# Altium project Atmega328P.PrjPcb
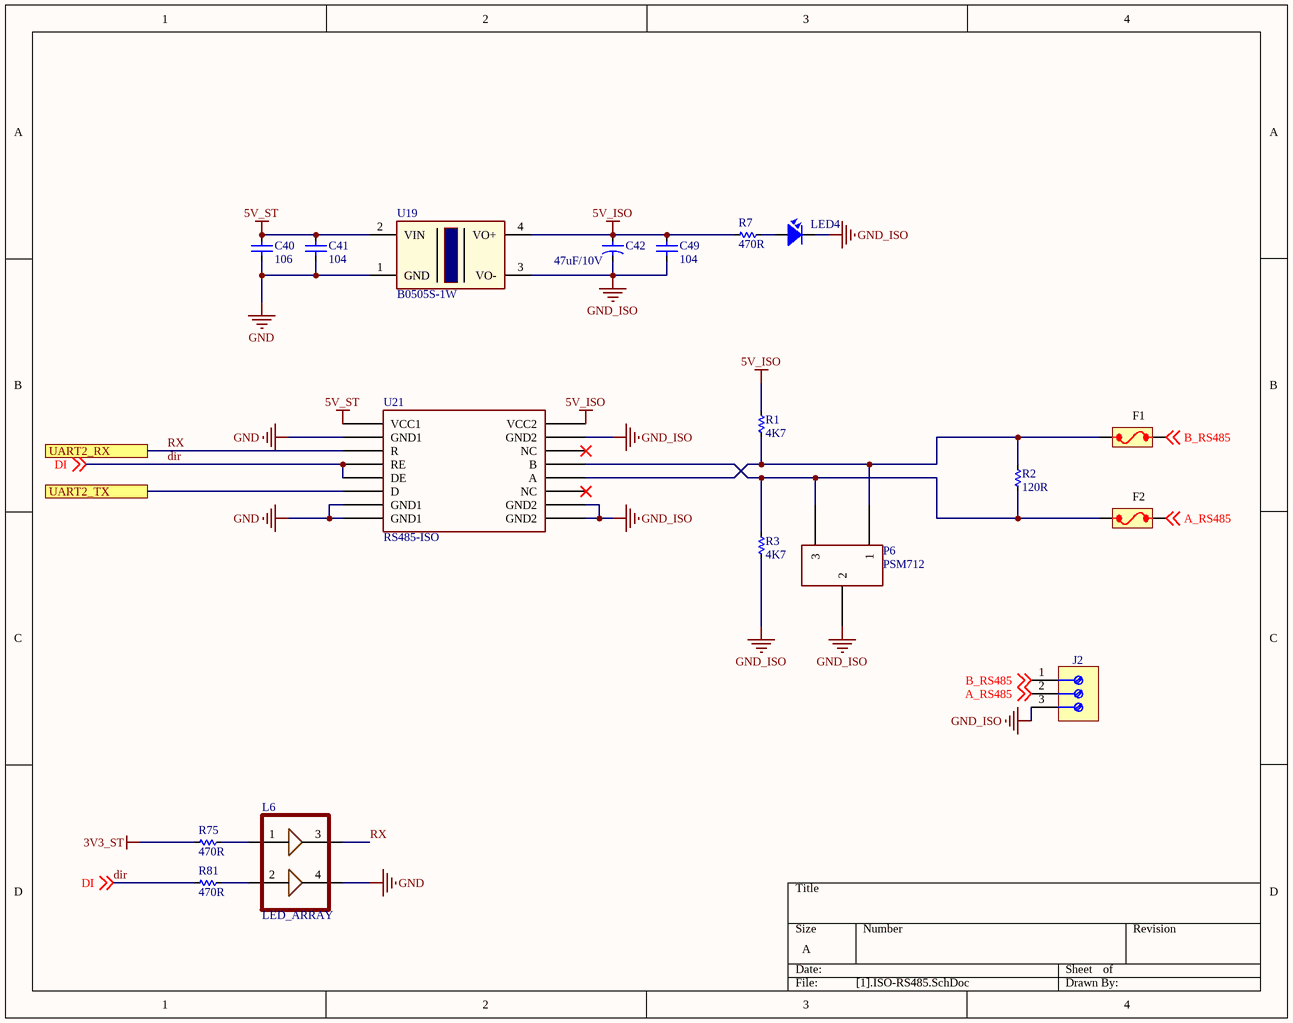
[diagram p0: [1].ISO-RS485.SchDoc]
2 sheets, 194 parts. Net scope: flat (ports and power ports of the same name join across sheets).
Board file: PCB_Atmega328P.PcbDoc
Sheets:
  [1].ISO-RS485.SchDoc
  Atmega328P.~(23).SchDoc

## Sheet [1].ISO-RS485.SchDoc
size A

### Parts
C40  106  [CAP-1206-SC]
C41  104  [CAP-1206-SC]
C42  47uF/10V  [CAP 6.3X12X2.5]
C49  104  [CAP-1206-SC]
F1  FUSE  [FUSE_RESETTABLE_SMD_1812]  (value not drawn)
F2  FUSE  [FUSE_RESETTABLE_SMD_1812]  (value not drawn)
J2  (no value)  [PHOENIX_1803439]
L6  LED_ARRAY  [LED_ARRAY2]
LED4  LED RED 3mm  [LED-3MM-RED]  (value not drawn)
P6  PSM712  [SOT23C]
R1  4K7  [RES-SMD-0805]
R2  120R  [RES-SMD-0805]
R3  4K7  [RES-SMD-0805]
R7  470R  [RES-SMD-0805]
R75  470R  [RES-SMD-0805]
R81  470R  [RES-SMD-0805]
U19  B0505S-1W  [B0505S_1W]
U21  RS485-ISO  [SOIC127P1030X265-16N]

### Ports
UART2_RX, UART2_TX

### Nets
3V3_ST: R75.2
5V_ISO: C42.1 C49.1 R1.2 R7.2 U19.4(VO+) U21.16(VCC2)
5V_ST: C40.1 C41.1 U19.2(VIN) U21.1(VCC1)
GND: C40.2 C41.2 L6.4 U19.1(GND) U21.2(GND1) U21.7(GND1) U21.8(GND1)
GND_ISO: C42.2 C49.2 J2.3 LED4.2 P6.2 R3.1 U19.3(VO-) U21.9(GND2) U21.10(GND2) U21.15(GND2)
A_RS485: F2.2 J2.2 ; off-sheet A_RS485
B_RS485: F1.2 J2.1 ; off-sheet B_RS485
dir: R81.2 U21.4(RE) U21.5(DE) ; off-sheet DI  [also labelled DI]
RX: L6.3 U21.3(R) ; port UART2_RX
NetF1_1: F1.1 P6.1 R1.1 R2.2 U21.12(A)
NetF2_1: F2.1 P6.3 R2.1 R3.2 U21.13(B)
NetL6_1: L6.1 R75.1
NetL6_2: L6.2 R81.1
NetLED4_1: LED4.1 R7.1
NetU6_4: U21.6(D) ; port UART2_TX

Not connected (* = marked no-connect by the designer): U21 11(NC)* 14(NC)*

### Library data of the parts
C40 C41 C49 = CAP_NP: Value: 0.1
C42 = CAP 100uF/16V
F1 F2 = FUSE: Value: Cau chi ong 30A; Vendor: Digikey; Published: 13-April-2009; Publisher: Hoang Nguyen; ComponentLink1Description: Digikey Part Link; ComponentLink2Description: Open Datasheet; ComponentLink2URL: H:\LIBRARY\LIBRARY.Datasheet\
J2 = Terminal Block_3 Positions_Screw Connection: Terminal Block, 3 Positions, Screw Connection
LED4 = LED: LED Single colour Green and Red; Value: LED 3 ly Single Colour
R1-R3 R7 R75 R81 = Res-SMD: Resistor; Manufacturer: Generic Components; Class: Passive; Published: 08/06/2000; Publisher: Altium Hobart Technology Centre
U19 = B0505S-1W: MH_PN: MH003143; Value: B0505S-1W

## Sheet Atmega328P.~(23).SchDoc
size A1
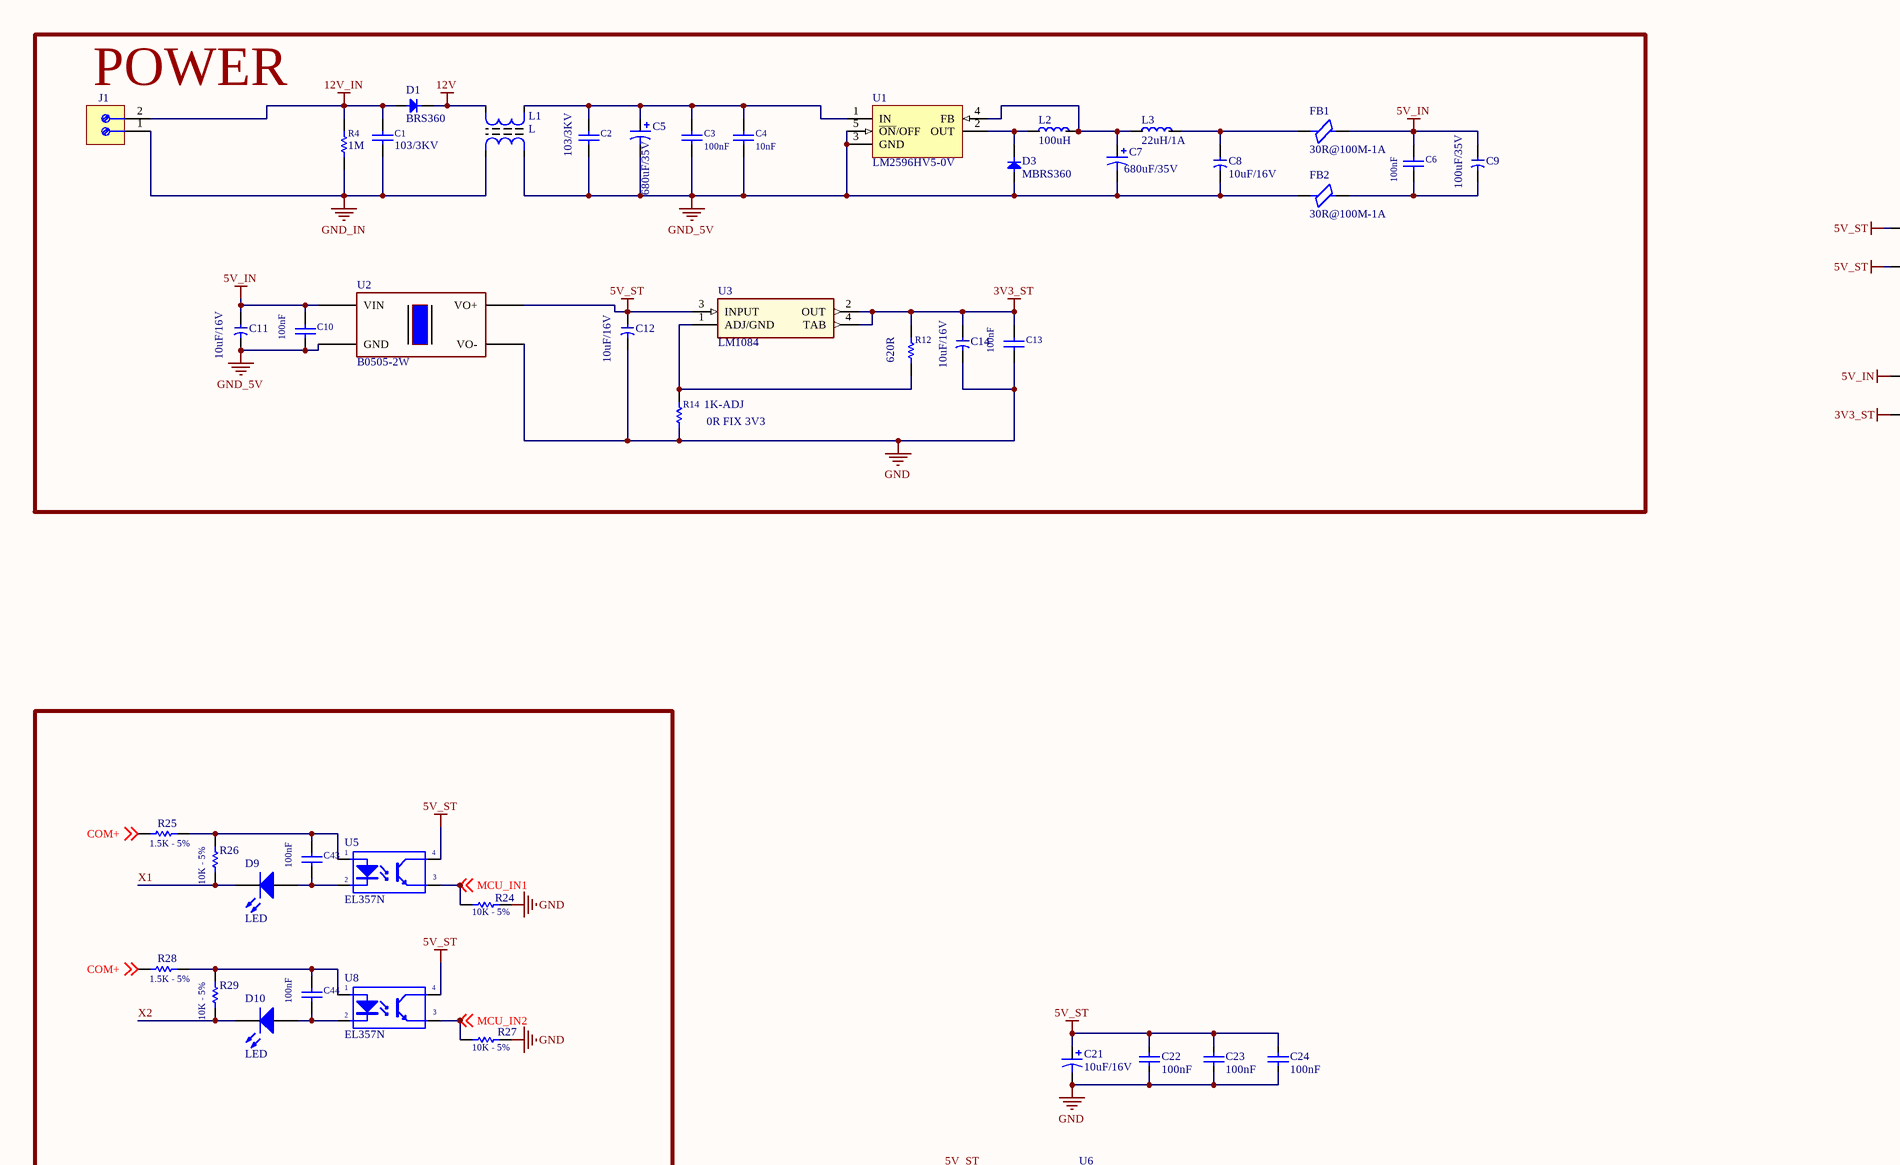
[diagram p1: Atmega328P.~(23).SchDoc, top left]
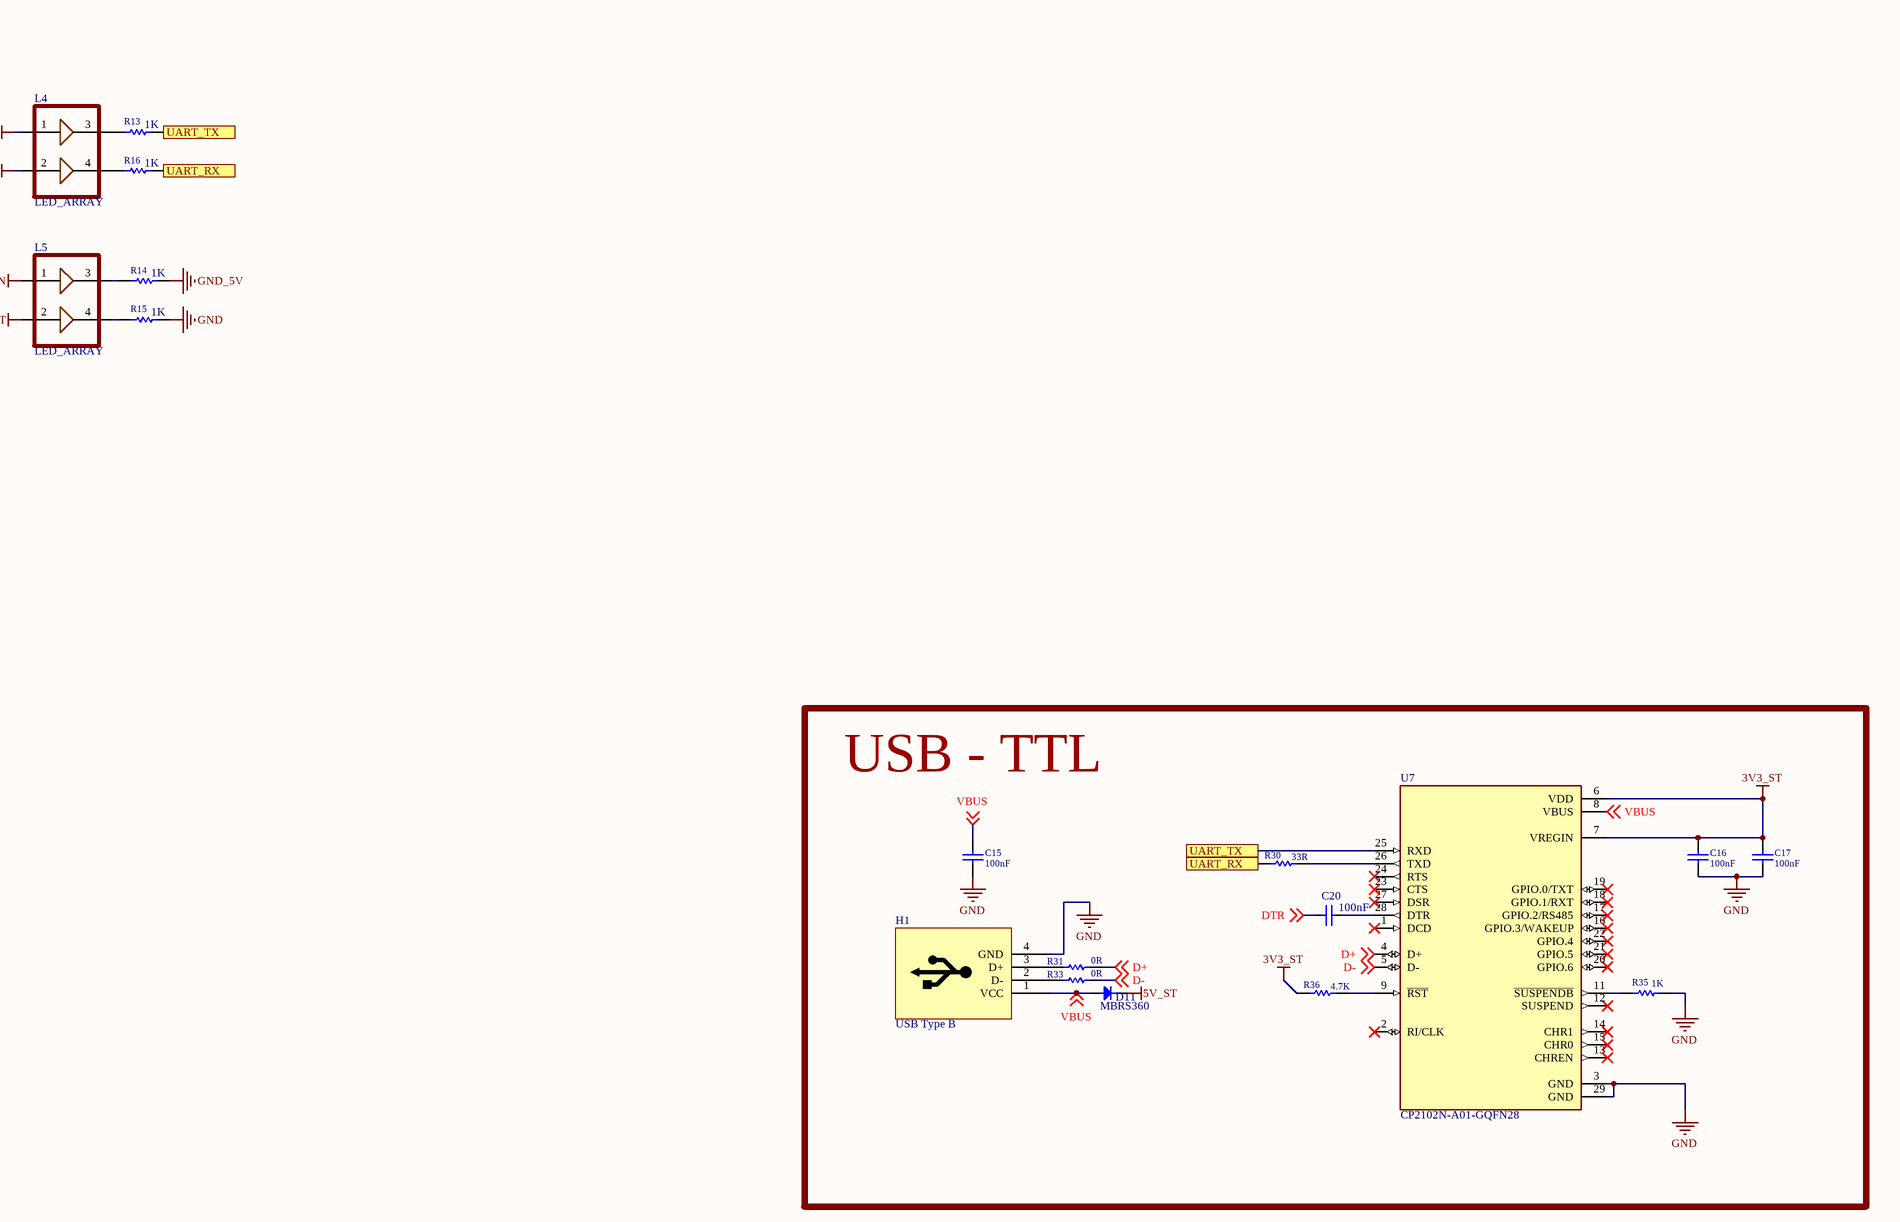
[diagram p2: Atmega328P.~(23).SchDoc, top right]
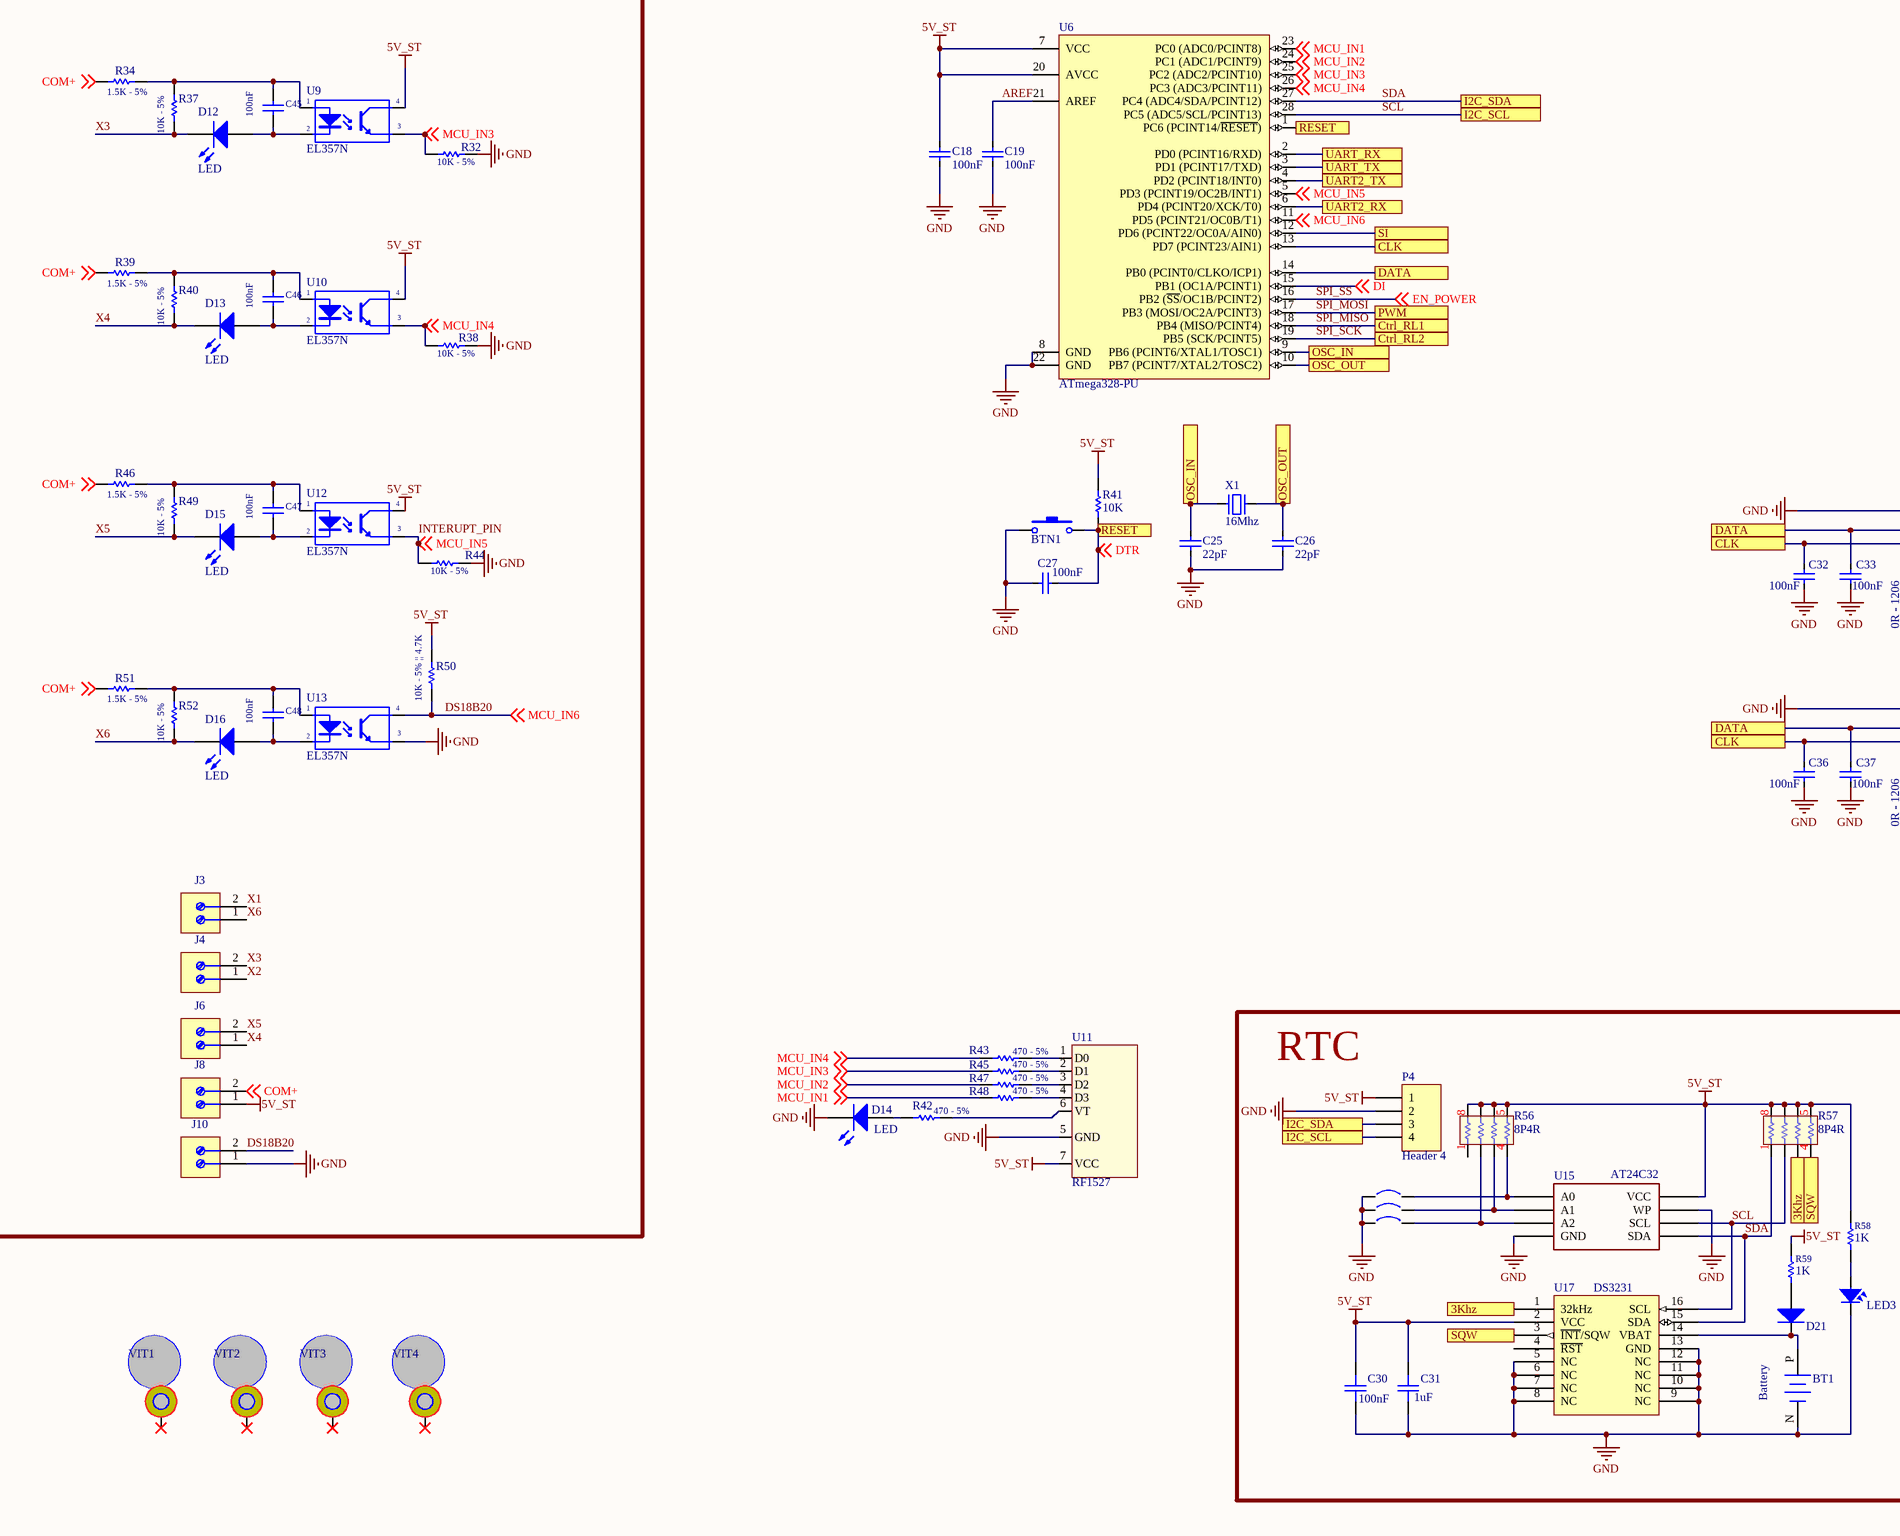
[diagram p3: Atmega328P.~(23).SchDoc, bottom left]
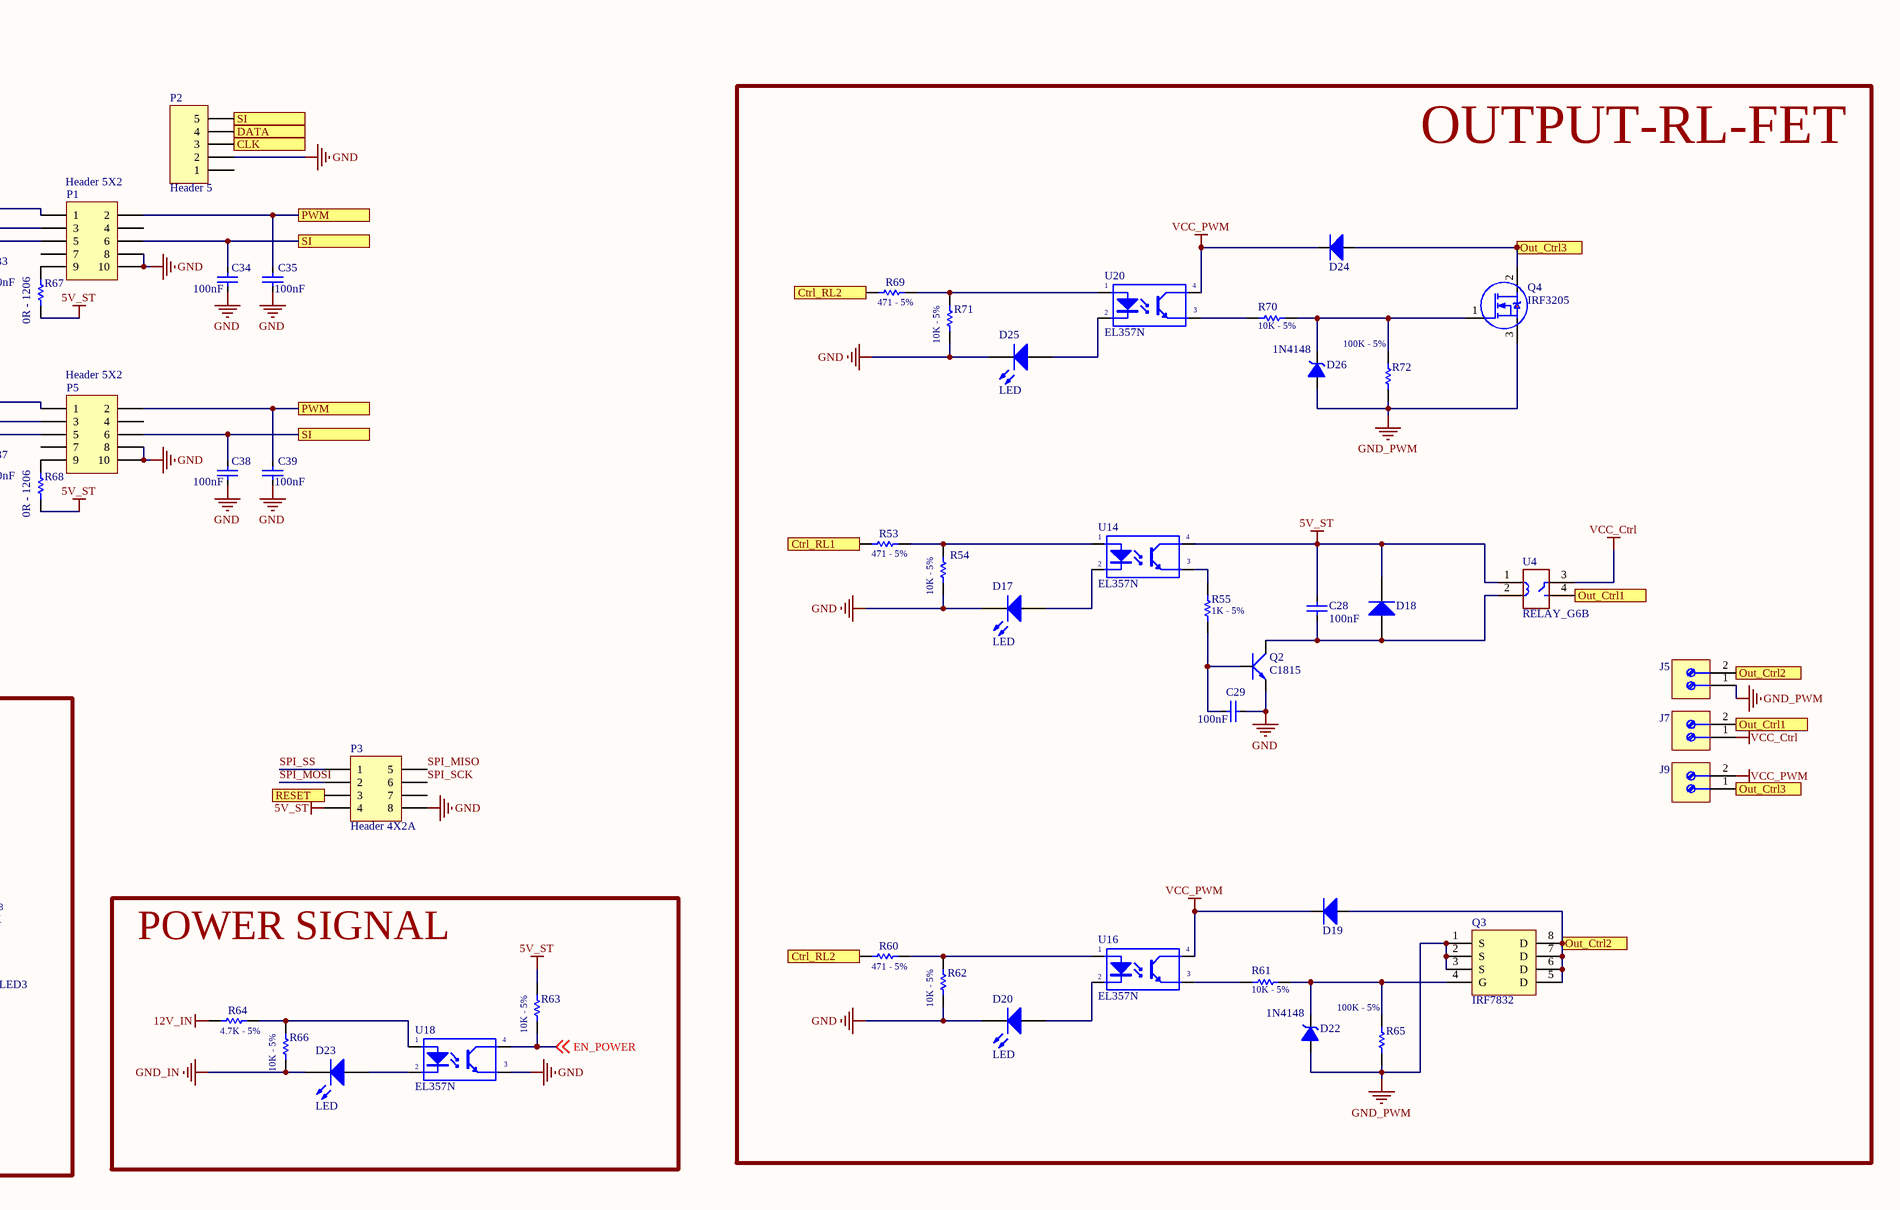
[diagram p4: Atmega328P.~(23).SchDoc, bottom right]

### Parts
(Parts that share a designator on the sheet are numbered #1, #2 ... from top to bottom, then left to right.)
BT1  Battery  [BAT_BC501SM]
BTN1  button SMD A 4 PIN  [BUTTON SMD A]  (value not drawn)
C1  103/3KV  [RAD-0.3]
C2  103/3KV  [RAD-0.3]
C3  100nF  [C2012-0805]
C4  10nF  [C2012-0805]
C5  680uF/35V  [C10mm]
C6  100nF  [C2012-0805]
C7  680uF/35V  [C10mm]
C8  10uF/16V  [C_Tanta 6032]
C9  100uF/35V  [C_Tanta 6032]
C10  100nF  [C2012-0805]
C11  10uF/16V  [C_Tanta 6032]
C12  10uF/16V  [C_Tanta 6032]
C13  100nF  [C2012-0805]
C14  10uF/16V  [C_Tanta 6032]
C15  100nF  [C2012-0805]
C16  100nF  [C2012-0805]
C17  100nF  [C2012-0805]
C18  100nF  [CAP-0805-SC]
C19  100nF  [CAP-0805-SC]
C20  100nF  [CAP-0805-SC]
C21  value 10uF/16V  [Cap size A]  (hidden comment: Cap Pol2)
C22  100nF  [CAP-0805-SC]
C23  100nF  [CAP-0805-SC]
C24  100nF  [CAP-0805-SC]
C25  22pF  [CAP-0805-SC]
C26  22pF  [CAP-0805-SC]
C27  100nF  [CAP-0805-SC]
C28  100nF  [CAP-0805-SC]
C29  100nF  [CAP-0805-SC]
C30  100nF  [CAPC-0603 (1608)]
C31  1uF  [CAPC-0603 (1608)]
C32  100nF  [CAP-0805-SC]
C33  100nF  [CAP-0805-SC]
C34  100nF  [CAP-0805-SC]
C35  100nF  [CAP-0805-SC]
C36  100nF  [CAP-0805-SC]
C37  100nF  [CAP-0805-SC]
C38  100nF  [CAP-0805-SC]
C39  100nF  [CAP-0805-SC]
C43  100nF  [C2012-0805]
C44  100nF  [C2012-0805]
C45  100nF  [C2012-0805]
C46  100nF  [C2012-0805]
C47  100nF  [C2012-0805]
C48  100nF  [C2012-0805]
CB1  Circuit Breaker  [2012]  (value not drawn)
CB2  Circuit Breaker  [2012]  (value not drawn)
CB3  Circuit Breaker  [2012]  (value not drawn)
D1  BRS360  [DO-214AB]
D3  MBRS360  [DO-214AC]
D9  LED  [LED_SMD_0805_GREEN]
D10  LED  [LED_SMD_0805_GREEN]
D11  MBRS360  [DO-214AC]
D12  LED  [LED_SMD_0805_GREEN]
D13  LED  [LED_SMD_0805_GREEN]
D14  LED  [LED_SMD_0805_GREEN]
D15  LED  [LED_SMD_0805_GREEN]
D16  LED  [LED_SMD_0805_GREEN]
D17  LED  [LED_SMD_0805_GREEN]
D18  1N4148  [1N4148_SMD]  (value not drawn)
D19  SS24  [DO-214AC]  (value not drawn)
D20  LED  [LED_SMD_0805_GREEN]
D21  1N4148  [SOD123-SC]  (value not drawn)
D22  1N4148  [1N4148_SMD]
D23  LED  [LED_SMD_0805_GREEN]
D24  SS24  [DO-214AC]  (value not drawn)
D25  LED  [LED_SMD_0805_GREEN]
D26  1N4148  [1N4148_SMD]
FB1  30R@100M-1A  [R2012-0805]
FB2  30R@100M-1A  [R2012-0805]
H1  USB Type B  [USB-S2]
J1  (no value)  [DOMINO 2P]
J3  (no value)  [DOMINO 2P]
J4  (no value)  [DOMINO 2P]
J5  (no value)  [DOMINO 2P]
J6  (no value)  [DOMINO 2P]
J7  (no value)  [DOMINO 2P]
J8  (no value)  [DOMINO 2P]
J9  (no value)  [DOMINO 2P]
J10  (no value)  [DOMINO 2P]
L1  L  [L2x220]
L2  100uH  [L_12x12x8]
L3  22uH/1A  [L_12x12x8]
L4  LED_ARRAY  [LED_ARRAY2]
L5  LED_ARRAY  [LED_ARRAY2]
LED3  LED RED 3mm  [LED-3MM-RED]  (value not drawn)
P1  Header 5X2  [HDR2X5]
P2  Header 5  [CON5]
P3  Header 4X2A  [HDR2X4_CEN]
P4  Header 4  [Header4]
P5  Header 5X2  [HDR2X5]
Q2  C1815  [SOT23B]
Q3  IRF7832  [SOIC 8]
Q4  IRF3205  [TO 263 [TO 220]]
R4  1M  [R2012-0805]
R12  620R  [R2012-0805]
R13  1K  [R2012-0805]
R14#1  1K  [R2012-0805]
R14#2  0R FIX 3V3  [R2012-0805]
R15  1K  [R2012-0805]
R16  1K  [R2012-0805]
R24  10K - 5%  [RES-0805-SC]
R25  1.5K - 5%  [RES-0805-SC]
R26  10K - 5%  [RES-0805-SC]
R27  10K - 5%  [RES-0805-SC]
R28  1.5K - 5%  [RES-0805-SC]
R29  10K - 5%  [RES-0805-SC]
R30  33R  [R2012-0805]
R31  0R  [R2012-0805]
R32  10K - 5%  [RES-0805-SC]
R33  0R  [R2012-0805]
R34  1.5K - 5%  [RES-0805-SC]
R35  1K  [R2012-0805]
R36  4.7K  [R2012-0805]
R37  10K - 5%  [RES-0805-SC]
R38  10K - 5%  [RES-0805-SC]
R39  1.5K - 5%  [RES-0805-SC]
R40  10K - 5%  [RES-0805-SC]
R41  10K  [RES-0805-SC]
R42  470 - 5%  [RES-0805-SC]
R43  470 - 5%  [RES-0805-SC]
R44  10K - 5%  [RES-0805-SC]
R45  470 - 5%  [RES-0805-SC]
R46  1.5K - 5%  [RES-0805-SC]
R47  470 - 5%  [RES-0805-SC]
R48  470 - 5%  [RES-0805-SC]
R49  10K - 5%  [RES-0805-SC]
R50  10K - 5% || 4.7K  [RES-0805-SC]
R51  1.5K - 5%  [RES-0805-SC]
R52  10K - 5%  [RES-0805-SC]
R53  471 - 5%  [RES-0805-SC]
R54  10K - 5%  [RES-0805-SC]
R55  1K - 5%  [RES-0805-SC]
R56  8P4R  [R-8P4R]
R57  8P4R  [R-8P4R]
R58  1K  [R2012-0805]
R59  1K  [R2012-0805]
R60  471 - 5%  [RES-0805-SC]
R61  10K - 5%  [RES-0805-SC]
R62  10K - 5%  [RES-0805-SC]
R63  10K - 5%  [RES-0805-SC]
R64  4.7K - 5%  [RES-0805-SC]
R65  100K - 5%  [RES-0805-SC]
R66  10K - 5%  [RES-0805-SC]
R67  value 0R - 1206  [RES-1206-SC]  (hidden comment: 0R)
R68  value 0R - 1206  [RES-1206-SC]  (hidden comment: 0R)
R69  471 - 5%  [RES-0805-SC]
R70  10K - 5%  [RES-0805-SC]
R71  10K - 5%  [RES-0805-SC]
R72  100K - 5%  [RES-0805-SC]
U1  LM2596HV5-0V  [D2-PACK5]
U2  B0505-2W  [B0505-2W]
U3  LM1084  [TO-263_LM1084]
U4  RELAY_G6B  [RELAY_G6B-1114P]
U5  EL357N  [SOIC254P680X220-4N]
U6  ATmega328-PU  [DIP28]
U7  CP2102N-A01-GQFN28  [CP2102]
U8  EL357N  [SOIC254P680X220-4N]
U9  EL357N  [SOIC254P680X220-4N]
U10  EL357N  [SOIC254P680X220-4N]
U11  RF1527  [RF1527]
U12  EL357N  [SOIC254P680X220-4N]
U13  EL357N  [SOIC254P680X220-4N]
U14  EL357N  [SOIC254P680X220-4N]
U15  AT24C32  [SOP65P490X110-8BN]
U16  EL357N  [SOIC254P680X220-4N]
U17  DS3231  [SL3016]
U18  EL357N  [SOIC254P680X220-4N]
U20  EL357N  [SOIC254P680X220-4N]
VIT1  VIT3mm  [vit 3mm]  (value not drawn)
VIT2  VIT3mm  [vit 3mm]  (value not drawn)
VIT3  VIT3mm  [vit 3mm]  (value not drawn)
VIT4  VIT3mm  [vit 3mm]  (value not drawn)
X1  16Mhz  [XTAL-RU49/4]

### Blocks framed on the sheet
POWER: C1-C14 D1 D3 FB1 FB2 J1 L1-L3 R4 R12 R14#2 U1-U3
USB - TTL: C15-C17 C20 D11 H1 R30 R31 R33 R35 R36 U7
OUTPUT-RL-FET: C28 C29 D17-D20 D22 D24-D26 J5 J7 J9 Q2-Q4 R53-R55 R60-R62 R65 R69-R72 U4 U14 U16 U20
RTC: BT1 C30 C31 CB1-CB3 D21 LED3 P4 R56-R59 U15 U17
POWER SIGNAL: D23 R63 R64 R66 U18

### Ports
3Khz, CLK, Ctrl_RL1, Ctrl_RL2, DATA, I2C_SCL, I2C_SDA, OSC_IN, OSC_OUT, Out_Ctrl1, Out_Ctrl2, Out_Ctrl3, PWM, RESET, SI, SQW, UART2_RX, UART2_TX, UART_RX, UART_TX

### Nets
3V3_ST: C13.1 C14.1 C16.2 C17.2 L5.2 R12.1 R36.1 U3.2(OUT) U3.4(TAB) U7.6(VDD) U7.7(VREGIN)
5V_IN: C6.1 C9.1 C10.1 C11.1 FB1.1 L5.1 U2.VIN
5V_ST: C12.1 C18.1 C21.1 C22.1 C23.1 C24.1 C28.2 C30.1 C31.1 D11.K D18.2(K) J8.1 L4.1 L4.2 P3.4 P4.1 R41.2 R50.2 R56.5(GND) R56.6(GND) R56.7(GND) R56.8(GND) R57.5(GND) R57.6(GND) R57.7(GND) R57.8(GND) R58.1 R59.1 R63.2 R67.1 R68.1 U2.VO+ U3.3(INPUT) U4.1 U5.4(C) U6.7(VCC) U6.20(AVCC) U8.4(C) U9.4(C) U10.4(C) U11.7(VCC) U12.4(C) U14.4(C) U15.8(VCC) U17.2(VCC)
12V: D1.K L1.3
12V_IN: C1.1 D1.A J1.2 R4.1 R64.1
GND: BT1.N BTN1.1 C12.2 C13.2 C14.2 C15.1 C16.1 C17.1 C18.2 C19.2 C21.2 C22.2 C23.2 C24.2 C25.2 C26.2 C27.1 C29.2 C30.2 C31.2 C32.1 C33.1 C34.1 C35.1 C36.1 C37.1 C38.1 C39.1 CB1.1 CB2.1 CB3.1 D14.2(K) D17.2(K) D20.2(K) D25.2(K) H1.4(GND) J10.1 LED3.2 P1.1 P1.8 P1.10 P2.2 P3.8 P4.2 P5.1 P5.8 P5.10 Q2.1(E) R14#2.2 R15.2 R24.1 R27.1 R32.1 R35.2 R38.1 R44.1 R54.1 R62.1 R71.1 U2.VO- U6.8(GND) U6.22(GND) U7.3(GND) U7.29(GND) U11.5(GND) U13.3(E) U15.4(GND) U15.7(WP) U17.5(NC) U17.6(NC) U17.7(NC) U17.8(NC) U17.9(NC) U17.10(NC) U17.11(NC) U17.12(NC) U17.13(GND) U18.3(E)
GND_5V: C2.2 C3.2 C4.2 C5.2 C7.2 C8.2 C10.2 C11.2 D3.A FB2.2 L1.1 R14#1.2 U1.3(GND) U1.5(~{ON}/OFF) U2.GND
GND_IN: C1.2 D23.2(K) J1.1 L1.2 R4.2 R66.1
GND_PWM: D22.1(A) D26.1(A) J5.1 Q3.1(S) Q3.2(S) Q3.3(S) Q4.3(S) R65.1 R72.1
VCC_Ctrl: J7.1 U4.3
VCC_PWM: D19.2(K) D24.2(K) J9.2 U16.4(C) U20.4(C)
AREF: C19.1 U6.21(AREF)
COM+: J8.2 R25.1 R28.1 R34.1 R39.1 R46.1 R51.1 ; off-sheet COM+
D+: R31.2 U7.4(D+) ; off-sheet D+
D-: R33.2 U7.5(D-) ; off-sheet D-
DI: U6.15(PB1_(OC1A/PCINT1)) ; off-sheet DI  [project net dir]
DS18B20: J10.2 R50.1 U6.11(PD5_(PCINT21/OC0B/T1)) U13.4(C) ; off-sheet MCU_IN6  [also labelled MCU_IN6]
DTR: BTN1.2 C20.1 C27.2 P3.3 R41.1 U6.1(PC6_(PCINT14/~{RESET})) ; off-sheet DTR, port RESET
INTERUPT_PIN: R44.2 U6.5(PD3_(PCINT19/OC2B/INT1)) U12.3(E) ; off-sheet MCU_IN5  [also labelled MCU_IN5]
MCU_IN1: R24.2 R48.2 U5.3(E) U6.23(PC0_(ADC0/PCINT8)) ; off-sheet MCU_IN1
MCU_IN2: R27.2 R47.2 U6.24(PC1_(ADC1/PCINT9)) U8.3(E) ; off-sheet MCU_IN2
MCU_IN3: R32.2 R45.2 U6.25(PC2_(ADC2/PCINT10)) U9.3(E) ; off-sheet MCU_IN3
MCU_IN4: R38.2 R43.2 U6.26(PC3_(ADC3/PCINT11)) U10.3(E) ; off-sheet MCU_IN4
RX: U6.6(PD4_(PCINT20/XCK/T0)) ; port UART2_RX
SCL: P4.4 R57.2(GND) U6.28(PC5_(ADC5/SCL/PCINT13)) U15.6(SCL) U17.16(SCL) ; port I2C_SCL
SDA: P4.3 R57.1(GND) U6.27(PC4_(ADC4/SDA/PCINT12)) U15.5(SDA) U17.15(SDA) ; port I2C_SDA
SPI_MISO: P3.5 R53.1 U6.18(PB4_(MISO/PCINT4)) ; port Ctrl_RL1
SPI_MOSI: C35.2 C39.2 P1.2 P3.2 P5.2 U6.17(PB3_(MOSI/OC2A/PCINT3)) ; port PWM
SPI_SCK: P3.6 R60.1 R69.1 U6.19(PB5_(SCK/PCINT5)) ; port Ctrl_RL2
SPI_SS: P3.1 R63.1 U6.16(PB2_(~{SS}/OC1B/PCINT2)) U18.4(C) ; off-sheet EN_POWER  [also labelled EN_POWER]
VBUS: C15.2 D11.A H1.1(VCC) U7.8(VBUS) ; off-sheet VBUS
X1: D9.2(K) J3.2 R26.1
X2: D10.2(K) J4.1 R29.1
X3: D12.2(K) J4.2 R37.1
X4: D13.2(K) J6.1 R40.1
X5: D15.2(K) J6.2 R49.1
X6: D16.2(K) J3.1 R52.1
NetBT1_P: BT1.P D21.2(K) U17.14(VBAT)
NetC2_1: C2.1 C3.1 C4.1 C5.1 L1.4 U1.1(IN)
NetC6_2: C6.2 C9.2 FB2.1
NetC7_1: C7.1 L2.2 L3.1 U1.4(FB)
NetC8_1: C8.1 FB1.2 L3.2
NetC20_2: C20.2 U7.28(DTR)
NetC25_1: C25.1 U6.9(PB6_(PCINT6/XTAL1/TOSC1)) X1.1 ; port OSC_IN
NetC26_1: C26.1 U6.10(PB7_(PCINT7/XTAL2/TOSC2)) X1.2 ; port OSC_OUT
NetC28_1: C28.1 D18.1(A) Q2.2(C) U4.2
NetC29_1: C29.1 Q2.3(B) R55.1
NetC32_2: C32.2 C36.2 P1.5 P2.3 P5.5 U6.13(PD7_(PCINT23/AIN1)) ; port CLK
NetC33_2: C33.2 C37.2 P1.3 P2.4 P5.3 U6.14(PB0_(PCINT0/CLKO/ICP1)) ; port DATA
NetC34_2: C34.2 C38.2 P1.6 P2.5 P5.6 U6.12(PD6_(PCINT22/OC0A/AIN0)) ; port SI
NetC43_1: C43.1 R25.2 R26.2 U5.1(A)
NetC43_2: C43.2 D9.1(A) U5.2(K)
NetC44_1: C44.1 R28.2 R29.2 U8.1(A)
NetC44_2: C44.2 D10.1(A) U8.2(K)
NetC45_1: C45.1 R34.2 R37.2 U9.1(A)
NetC45_2: C45.2 D12.1(A) U9.2(K)
NetC46_1: C46.1 R39.2 R40.2 U10.1(A)
NetC46_2: C46.2 D13.1(A) U10.2(K)
NetC47_1: C47.1 R46.2 R49.2 U12.1(A)
NetC47_2: C47.2 D15.1(A) U12.2(K)
NetC48_1: C48.1 R51.2 R52.2 U13.1(A)
NetC48_2: C48.2 D16.1(A) U13.2(K)
NetCB1_2: CB1.2 R56.4(GND) U15.1(A0)
NetCB2_2: CB2.2 R56.3(GND) U15.2(A1)
NetCB3_2: CB3.2 R56.2(GND) U15.3(A2)
NetD3_K: D3.K L2.1 U1.2(OUT)
NetD14_1: D14.1(A) R42.2
NetD17_1: D17.1(A) U14.2(K)
NetD19_1: D19.1(A) J5.2 Q3.5(D) Q3.6(D) Q3.7(D) Q3.8(D) ; port Out_Ctrl2
NetD20_1: D20.1(A) U16.2(K)
NetD21_1: D21.1(A) R59.2
NetD22_2: D22.2(K) Q3.4(G) R61.1 R65.2
NetD23_1: D23.1(A) U18.2(K)
NetD24_1: D24.1(A) J9.1 Q4.2(D) ; port Out_Ctrl3
NetD25_1: D25.1(A) U20.2(K)
NetD26_2: D26.2(K) Q4.1(G) R70.1 R72.2
NetH1_2: H1.2(D-) R33.1
NetH1_3: H1.3(D+) R31.1
NetJ7_2: J7.2 U4.4 ; port Out_Ctrl1
NetL4_3: L4.3 R13.1
NetL4_4: L4.4 R16.1
NetL5_3: L5.3 R14#1.1
NetL5_4: L5.4 R15.1
NetLED3_1: LED3.1 R58.2
NetP1_9: P1.9 R67.2
NetP5_9: P5.9 R68.2
NetR12_2: R12.2 R14#2.1 U3.1(ADJ/GND)
NetR13_2: R13.2 U6.3(PD1_(PCINT17/TXD)) U7.25(RXD) ; port UART_TX
NetR16_2: R16.2 R30.1 U6.2(PD0_(PCINT16/RXD)) ; port UART_RX
NetR30_2: R30.2 U7.26(TXD)
NetR35_1: R35.1 U7.11(~{SUSPENDB})
NetR36_2: R36.2 U7.9(~{RST})
NetR42_1: R42.1 U11.6(VT)
NetR43_1: R43.1 U11.1(D0)
NetR45_1: R45.1 U11.2(D1)
NetR47_1: R47.1 U11.3(D2)
NetR48_1: R48.1 U11.4(D3)
NetR53_2: R53.2 R54.2 U14.1(A)
NetR55_2: R55.2 U14.3(E)
NetR57_3: R57.3(GND) U17.1(32kHz) ; port 3Khz
NetR57_4: R57.4(GND) U17.3(~{INT}/SQW) ; port SQW
NetR60_2: R60.2 R62.2 U16.1(A)
NetR61_2: R61.2 U16.3(E)
NetR64_2: R64.2 R66.2 U18.1(A)
NetR69_2: R69.2 R71.2 U20.1(A)
NetR70_2: R70.2 U20.3(E)
NetU6_4: U6.4(PD2_(PCINT18/INT0)) ; port UART2_TX

Not connected (* = marked no-connect by the designer): H1 5 6; P1 4 7; P2 1; P3 7; P5 4 7; R56 1(GND); U7 1(DCD)* 2(RI/CLK)* 12(SUSPEND)* 13(CHREN)* 14(CHR1)* 15(CHR0)* 16(GPIO.3/WAKEUP)* 17(GPIO.2/RS485)* 18(GPIO.1/RXT)* 19(GPIO.0/TXT)* 20(GPIO.6)* 21(GPIO.5)* 22(GPIO.4)* 23(CTS)* 24(RTS)* 27(DSR)*; U17 4(~{RST}); VIT1 1*; VIT2 1*; VIT3 1*; VIT4 1*

### Notes on the sheet
- (near R14#2) 1K-ADJ
- Title
- Size:
- Date:
- File:
- A1
- Number:
- Time:
- Revision:
- Sheet
- of

### Library data of the parts
BT1 = Battery: Multicell Battery; Published: 24-Mar-1999; LatestRevisionDate: 17-Jul-2002; LatestRevisionNote: Re-released for DXP Platform.; PackageReference: BAT-2; Publisher: Altium Limited
BTN1 = BUTTON
C1-C4 C6 C10 C13 C15-C17 C43-C48 = Capacitor: Manufacturer PN: C0805C101J5GACTU; Manufacturer: KEMET; Decription: CAP CER 100PF 50V C0G/NP0 0805; Digi-Key PN: 399-1122-1-ND; FootPrint: 0805 (2012 Metric)
  C1 C2: Value: 103/3KV
  C3 C6 C10 C13 C15-C17 C43-C48: Value: 100nF
  C4: Value: 10nF
C5 C7 = Cap Pol 12mm: Polarized Capacitor (Axial); Published: 8-Jun-2000; LatestRevisionDate: 17-Jul-2002; LatestRevisionNote: Re-released for DXP Platform.; PackageReference: POLAR0.8; Publisher: Altium Limited
C8 C9 C11 C12 C14 = Capacitor_Pol: Manufacturer: AVX Corporation; Manufacturer PN: TAJA106K016RNJ; Decription: CAP TANT 10UF 16V 10% 1206; MH_PN: MH007474; FootPrint: 1206 (3216 Metric); Digi-Key PN: 478-1655-1-ND
C18-C20 C22-C29 C32-C39 = CAP_NP: Value: 0.1
C21 = Cap Pol2: Polarized Capacitor (Axial); Published: 8-Jun-2000; LatestRevisionDate: 17-Jul-2002; LatestRevisionNote: Re-released for DXP Platform.; PackageReference: POLAR0.8; Publisher: Altium Limited
C30 C31 = CAPC NF 0603: CAP SMD, Not Fill, 0603; Value: NF; Solder: Not Fill; Category: CAPACITOR
D1 D3 D11 = Diode: Manufacturer: ON Semiconductor; Manufacturer PN: MBRS340T3G; Decription: DIODE SCHOTTKY 40V 4A SMC; MH_PN: MH002728; Value: MBRS340T3G; Digi-Key PN: MBRS340T3GOSTR-ND; FootPrint: DO-214AB, SMC
D9 D10 D12-D17 D20 D23 D25 = LED: Typical INFRARED GaAs LED; Published: 8-Jun-2000; LatestRevisionDate: 08-Jul-2005; LatestRevisionNote: Mech Layer 1 removed.; PackageReference: LED-0; Publisher: Altium Limited
D18 = Diode: Default Diode; Published: 8-Jun-2000; LatestRevisionDate: 17-Jul-2002; LatestRevisionNote: Re-released for DXP Platform.; PackageVersion: Sep-1996; PackageReference: SMC; Publisher: Altium Limited; Code_JEDEC: DO-214-AB
D19 D21 D24 = DIODE: Value: 1N4007
D22 D26 = DZ: Diode Zenner; Value: 3v3
FB1 FB2 = BEAD FERRITE/SM_1: Value: FBMH2012; ComponentLink1Description: Digikey Part Link; ComponentLink2Description: Open Datasheet; ComponentLink2URL: H:\LIBRARY\LIBRARY.Datasheet\
H1 = USB: USB conector
J1 J3-J10 = Terminal Block_2 Positions_Screw Connection: Terminal Block, 2 Positions, Screw Connection
L1 = L2: Inductor; Value: Loc 220; Designed by: VanDungEvn
L2 L3 = Inductor: Inductor 100uH 12x12x7; Manufacturer PN: 7447709101; Manufacturer: Wurth Electronics Inc.; Decription: FIXED IND 100UH 2.5A 110 MOHM; MH_PN: MH001797; Digi-Key PN: 732-1248-1-ND; FootPrint: Surface Mount; Value: 100uH 12x12x7
LED3 = LED: as LED4 on sheet [1].ISO-RS485
P1 P5 = Header 5X2: Header, 5-Pin, Dual row; LatestRevisionDate: 17-Jul-2002; LatestRevisionNote: Re-released for DXP Platform.; Publisher: Altium Limited
P2 = Header 5: Header, 5-Pin; LatestRevisionDate: 17-Jul-2002; LatestRevisionNote: Re-released for DXP Platform.; Publisher: Altium Limited
P3 = Header 4X2A: Header, 4-Pin, Dual row; LatestRevisionDate: 17-Jul-2002; LatestRevisionNote: Re-released for DXP Platform.; Publisher: Altium Limited
P4 = Header 4: Header, 4-Pin; LatestRevisionDate: 17-Jul-2002; LatestRevisionNote: Re-released for DXP Platform.; Publisher: Altium Limited
Q2 = C1815: NPN 600mW, ECB; Value: C1815
Q3 = MOSFET N [SOIC]
Q4 = MOSFET N typeB
R4 R12 R13 R14#1 R14#2 R15 R16 R30 R31 R33 R35 R36 R58 R59 = Resistor: Manufacturer: Yageo; Manufacturer PN: RC0805JR-071KL; Decription: RES SMD 1K OHM 5% 1/8W 0805; Digi-Key PN: 311-1.0KARCT-ND; FootPrint: 0805 (2012 Metric)
  R4: Value: 1M
  R12: Value: 620R
  R13 R14#1 R15 R16 R35 R58 R59: Value: 1K
  R14#2: Value: 0R FIX 3V3
  R30: Value: 33R
  R36: Value: 4.7K
R24-R29 R32 R34 R37-R55 R60-R66 R69-R72 = RES
R56 R57 = R-8P4R: Resistor array
R67 R68 = Resistor: Semiconductor Resistor; Published: 8-Jun-2000; LatestRevisionDate: 17-Jul-2002; LatestRevisionNote: Re-released for DXP Platform.; PackageReference: AXIAL-0.5; Publisher: Altium Limited
U1 = LM2576: Simple Switcher 3A Step Down Voltage Regulator; Manufacturer PN: LM2596S-3.3/NOPB; Manufacturer: Texas Instruments; Decription: IC REG BUCK 3.3V 3A TO263-5; Value: LM2596-5V; FootPrint: DDPAK/TO-263-5; Digi-Key PN: LM2596S-3.3/NOPB-ND
U3 = LM1084: LM1084-TO-263; Value: LM1084-TO-263
U4 = RELAY_G6B: G6B-1114P-FD-US-DC12
U5 U8-U10 U12-U14 U16 U18 U20 = Opto 1: Single; Value: TLP5211
U6 = ATmega328-PU: 8-bit AVR Microcontroller, 32KB Flash, 1KB EEPROM, 2KB SRAM, 28-pin PDIP, Industrial Grade (-40°C to 85°C); Published: 1-Apr-2010; DatasheetVersion: revA, Jan-2010; PackageVersion: revB, Sep-2001; PackageReference: 28P3; Publisher: Altium Limited; PackageDescription: 28-lead (0.300"/7.62mm Wide) Plastic Dual Inline Package (PDIP); Supplier 1: Digi-Key; Supplier Part Number 1: ATMEGA328-PU-ND; Supplier 2: Mouser; Supplier Part Number 2: 556-ATMEGA328-PU; ComponentLink1Description: Manufacturer Link; ComponentLink1URL: http://www.atmel.com/products/avr/default.asp?; ComponentLink2Description: ATmega48A/48PA/88A/88PA/168A/168PA/328/328P Datasheet; ComponentLink2URL: http://www.atmel.com/dyn/resources/prod_documents/8271.pdf; ComponentLink3Description: ATmega48A/48PA/88A/88PA/168A/168PA/328/328P Summary; ComponentLink3URL: http://www.atmel.com/dyn/resources/prod_documents/8271S.pdf; ComponentLink4Description: Atmel.com Home; ComponentLink4URL: http://www.atmel.com
U7 = CP2102N-A01-GQFN28: USB Bridge, USB to UART USB 2.0 UART Interface 28-QFN _5x5_; MF: Silicon Labs; Package: QFN-28 Silicon Labs; Availability: Unavailable; MP: CP2102N-A01-GQFN28; Value: *; SnapEDA_Link: https://www.snapeda.com/parts/CP2102N-A01-GQFN28/Silicon%20Labs/view-part/554799/?ref=snap; Price: None
VIT1-VIT4 = VIT3mm: VIT; LatestRevisionDate: 17-Jul-2002; LatestRevisionNote: Re-released for DXP Platform.; Publisher: Altium Limited
X1 = XT2: Crystal, 32.768 KHz, -40 to 85 degC, 3.2 x 1.5 x 0.9 mm SMD; Value: 4Mhz

## Nets that join several sheets
3V3_ST: [1].ISO-RS485 (R75.2), Atmega328P.~(23) (11 pins)
5V_ST: [1].ISO-RS485 (C40.1 C41.1 U19.2 U21.1), Atmega328P.~(23) (45 pins)
GND: [1].ISO-RS485 (7 pins), Atmega328P.~(23) (78 pins)
dir: [1].ISO-RS485 (R81.2 U21.4 U21.5), Atmega328P.~(23) (U6.15)
NetU6_4: [1].ISO-RS485 (U21.6), Atmega328P.~(23) (U6.4)
RX: [1].ISO-RS485 (L6.3 U21.3), Atmega328P.~(23) (U6.6)